# Altium schematic sheet 1_PowerSupply.SchDoc
size A4; Revision: 1.0; SheetNumber: 1; SheetTotal: 4
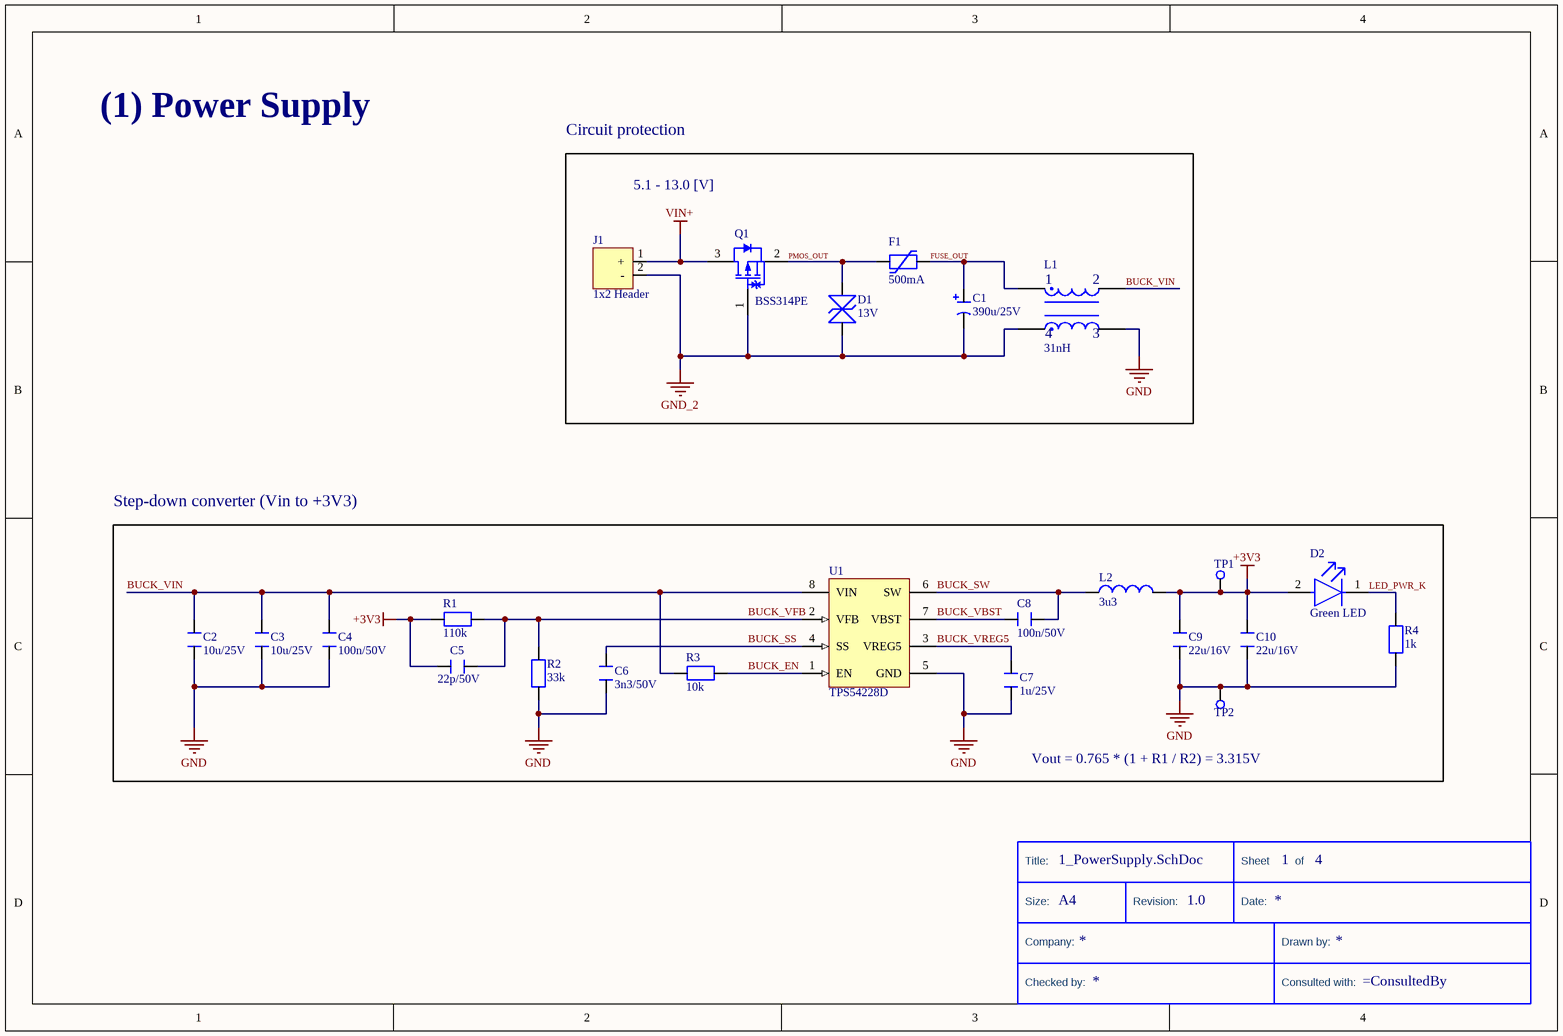
[diagram p0: 1_PowerSupply.SchDoc]

## Parts
*  Size: A4  (hidden comment: TitleBlock)  (graphical)
C1  390u/25V  [CAP_ELECTROLYTIC D8]
C2  10u/25V  [CAP_1206]
C3  10u/25V  [CAP_1206]
C4  100n/50V  [CAP_1206]
C5  22p/50V  [CAP_1206]
C6  3n3/50V  [CAP_1206]
C7  1u/25V  [CAP_1206]
C8  100n/50V  [CAP_1206]
C9  22u/16V  [CAP_1206]
C10  22u/16V  [CAP_1206]
D1  13V  [TVS_Littlefuse]
D2  Green LED  [FP-LTST-C150KGKT-MFG]
F1  500mA  [Fuse_1210]
J1  1x2 Header  [1x2 Header (Terminal Block 5.08mm)]
L1  31nH  [CMC-1206USB]
L2  3u3  [IND_DJNR5020-3R3-S]
Q1  BSS314PE  [INF-PG-SOT23_N]
R1  110k  [RES_1206]
R2  33k  [RES_1206]
R3  10k  [RES_1206]
R4  1k  [RES_1206]
TP1  TestPoint Pad 1.0mmx1.0mm  [TestPoint Pad 1.0mmx1.0mm]  (value not drawn)
TP2  TestPoint Pad 1.0mmx1.0mm  [TestPoint Pad 1.0mmx1.0mm]  (value not drawn)
U1  TPS54228D  [D0008A_L]

## Blocks framed on the sheet
Circuit protection: C1 D1 F1 J1 L1 Q1
Step-down converter (Vin to +3V3): C2-C10 D2 L2 R1-R4 TP1 TP2 U1

## Nets
+3V3: C5.2 C9.1 C10.1 D2.2(A) L2.2 R1.2 TP1.1
GND: C2.1 C3.1 C4.1 C6.1 C7.2 C9.2 C10.2 L1.3 R2.2 R4.2 TP2.1 U1.5(GND)
GND_2: C1.1 D1.2 J1.2(-) L1.4 Q1.1(GATE)
VIN+: J1.1(+) Q1.3(DRAIN)
BUCK_EN: R3.1 U1.1(EN)
BUCK_SS: C6.2 U1.4(SS)
BUCK_SW: C8.2 L2.1 U1.6(SW)
BUCK_VBST: C8.1 U1.7(VBST)
BUCK_VFB: C5.1 R1.1 R2.1 U1.2(VFB)
BUCK_VIN: C2.2 C3.2 C4.2 L1.2 R3.2 U1.8(VIN)
BUCK_VREG5: C7.1 U1.3(VREG5)
FUSE_OUT: C1.2 F1.2 L1.1
LED_PWR_K: D2.1(C) R4.1
PMOS_OUT: D1.1 F1.1 Q1.2(SOURCE)

## Notes on the sheet
- (1) Power Supply
- 5.1 - 13.0 [V]
- Vout = 0.765 * (1 + R1 / R2) = 3.315V
- (in symbol TitleBlock) Title:; Sheet; of; Size:; Revision:; Date:; Company:; Drawn by:; Checked by:; Consulted with:

## Library data of the parts
* = TitleBlock: Standard Title Block
C1 = CAP_ELECTROLYTIC D8
C2-C10 = CAP_1206: Generic 1206/3216 capacitor
D1 = TVS_13V: TVS Diode TVS_SMAJ13CA  13V Bidirectional
D2 = CMP-22017-000010-1: LED GREEN CLEAR 1206 SMD; Power Dissipation: 75mW; Number of LEDs: 1; Reverse Voltage: 5V; Lens Style: Diffused; Test Current: 20mA; Forward Current: 30mA; Luminous Intensity: 71mcd; Dominant Wavelength: 571nm; Lens Color: Colorless; Viewing Angle: 130°; Forward Voltage: 2V; Wavelength: 574nm; Length: 3.2mm; Case Code (Imperial): 1206; Illumination Color: Green; Number of Pins: 2; Case Code (Metric): 3216; Package Quantity: 1; Height: 1.1mm; Power Rating: 75mW; Color: Green; Lead Free: Lead Free; Mount: Surface Mount; Radiation Hardening: No; Max Operating Temperature: 85°C; Depth: 1.6mm; Case/Package: 1206; Number of Elements: 1; Lens Transparency: Clear; Min Operating Temperature: -55°C; Packaging: Tape and Reel; Width: 1.6mm
F1 = FUSE_0ZCH0050FF2G: FUSE 500mA/16V
J1 = 1x2 Header (Terminal Block 5.08mm): 1x2 Header, Through Hole(Terminal Block 5.08mm)
L1 = CMC-1206USB: 31nH @ 100MHz 2 Line Common Mode Choke Surface Mount 37 Ohms @ 100MHz 1A DCR 0.1 Ohms
L2 = IND_DJNR5020-3R3-S
Q1 = CMP-1099-00027-1: P-Channel OptiMOS P3 Small-Signal-Transistor, -30 V VDS, -1.5 A ID, -55 to 150 degC, PG-SOT23, Reel, Green; Manufacturer: Infineon; Rth: 250Â K/W; RDS (on) (max): 140Â mOhm; QG: -2.9Â nC; IDpuls (max): -6.1Â A; RDS (on) (max) (@4.5V): 230Â mOhm; Pto t (max): 0.5Â W; Green: TRUE; VDS (max): -30Â V; VGS(th) (max): -2Â V; VGS(th) (min): -1Â V; ID (max): -1.5Â A; ComponentLink2URL: http://www.infineon.com/dgdl/BSS314PE_rev2.3.pdf?folderId=db3a304314dca38901154a72e3951a65&fileId=db3a304330f68606013109b696aa0084; ComponentLink3Description: Package Specification; ComponentLink1URL: http://www.infineon.com/; ComponentLink1Description: Manufacturer URL; Mounting Technology: Surface Mount; PartNumber: BSS314PE; PackageReference: PG-SOT23; PackageVersion: Apr-08; Halogen-free: TRUE; ComponentLink3URL: http://www.infineon.com/dgdl/SOT23-Package_Overview.pdf?folderId=db3a30431936bc4b0119532290053c66&fileId=db3a30431936bc4b0119533468123c85; PackageDescription: 3-Pin Small Outline Transistor Package, 2.9 x 1.3 mm Body, 0.95 mm Pitch; ComponentLink2Description: Datasheet; DatasheetVersion: Rev. 2.3; Packing: Reel
R1-R4 = RES_1206: Generic 1206/3216 resistor
U1 = CMP-0323-00178-3: Buck Step Down Regulator with 4.5 to 18 V Input and 0.76 to 7 V Output, -40 to 85 degC, 8-Pin SOIC (D), Green (RoHS & no Sb/Br); Manufacturer: Texas Instruments; Iout(Max)(A): 2; Vout(Min)(V): 0.76; Switch Current Limit(Typ)(A): 3.3; Rating: Catalog; SubFamily: Step-Down Regulator; Vin(Max)(V): 18; Duty Cycle(Max)(%): 90; Iq(Typ)(mA): 0.8; Regulated Outputs(#): 1; Synchronous Rectification: TRUE; Vin(Min)(V): 4.5; Vout(Max)(V): 7; ComponentLink1Description: Datasheet; Topology: Buck; ComponentLink2Description: Package Specification; PackageVersion: revM, Jun-2011; Mounting Technology: Surface Mount; PackageDescription: 8-Pin Plastic Small Outline Integrated Circuit, 4.9 x 3.9 mm, Pitch 1.27 mm Pitch; ComponentLink3URL: Samples URL:http://www.ti.com/product/tps54228#samples; ComponentLink2URL: http://www.ti.com/litv/pdf/msoi002j; ComponentLink3Description: URL Link1; PartNumber: TPS54228D; Code_JEDEC: MS-012AA; DatasheetVersion: SLVSAU1C; Eco-Plan: Green (RoHS & no Sb/Br); ComponentLink1URL: http://www.ti.com/general/docs/lit/getliterature.tsp?genericPartNumber=TPS54228&fileType=pdf; PackageReference: D0008A